# Altium schematic sheet Sheet_1_2020-09-11_10-02-54.schdoc
size 263 x 167 mm
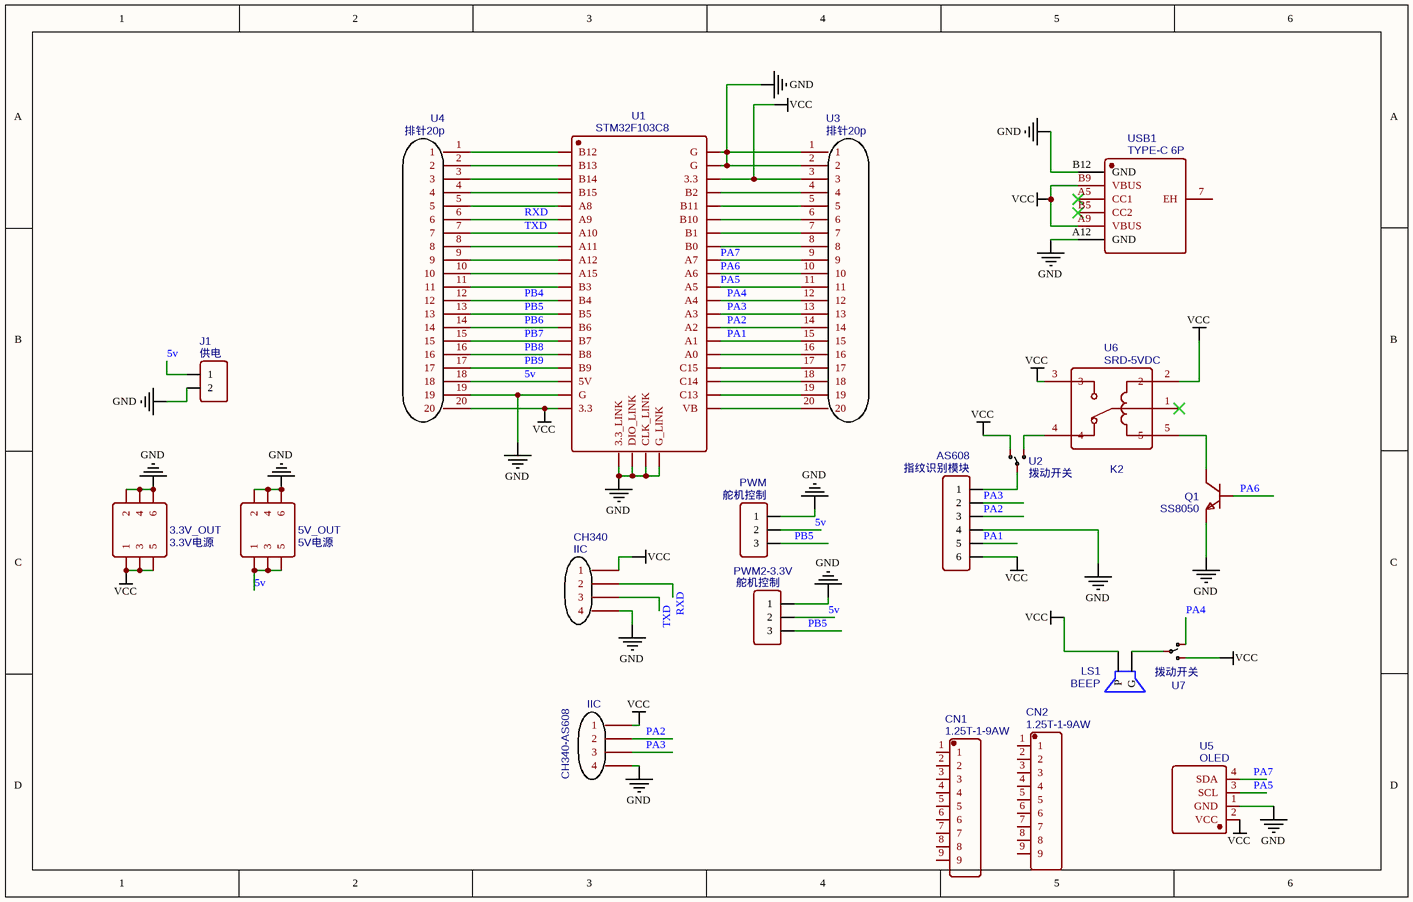
[diagram p0: Sheet_1_2020-09-11_10-02-54.schdoc]

## Parts
3.3V_OUT  3.3V电源  [HDR-TH_6P-P2.54-V-R2-C3-S2.54]
5V_OUT  5V电源  [HDR-TH_6P-P2.54-V-R2-C3-S2.54]
AS608  指纹识别模块  [HDR-M-2.54_1X6]
CH340  IIC  [HANDER*4]
CH340-AS608  IIC  [HANDER*4]
CN1  1.25T-1-9AW  [CONN-TH_9P-P1.25-H_1.25T-1-9AW]
CN2  1.25T-1-9AW  [CONN-TH_9P-P1.25-H_1.25T-1-9AW]
J1  供电  [HDR-M-2.54_1X2]
LS1  BEEP  [BEEP-9]
PWM  舵机控制  [HDR-M-2.54_1X3]
PWM2-3.3V  舵机控制  [HDR-M-2.54_1X3]
Q1  SS8050  [TO-92_FORMING1]
U1  STM32F103C8  [STM32F103C8T6-CORE]
U2  拨动开关  [拨动开关-SS12D00G3]
U3  排针20p  [排针-2.54间距-1*20P]
U4  排针20p  [排针-2.54间距-1*20P]
U5  OLED  [0.96_OLED]
U6  SRD-5VDC  [SRD-05VDC-SL-C]
U7  拨动开关  [拨动开关-SS12D00G3]
USB1  TYPE-C 6P  [TYPE-C-SMD_TYPE-C-6P]

## Nets
GND: 3.3V_OUT.2 3.3V_OUT.4 3.3V_OUT.6 5V_OUT.2 5V_OUT.4 5V_OUT.6 AS608.4 CH340.4 CH340-AS608.4 J1.2 PWM.1 PWM2-3.3V.1 Q1.1(E) U1.19(G) U1.39(G) U1.40(G) U1.41(3.3_LINK) U1.42(DIO_LINK) U1.43(CLK_LINK) U1.44(G_LINK) U3.1 U3.2 U4.19 U5.1(GND) USB1.A12(GND) USB1.B12(GND)
VCC: 3.3V_OUT.1 3.3V_OUT.3 3.3V_OUT.5 AS608.6 CH340.1 CH340-AS608.1 LS1.1(P) U1.20(3.3) U1.38(3.3) U2.3 U3.3 U4.20 U5.2(VCC) U6.2 U6.3 U7.1 USB1.A9(VBUS) USB1.B9(VBUS)
5v: 5V_OUT.1 5V_OUT.3 5V_OUT.5 J1.1 PWM.2 PWM2-3.3V.2 U1.18(5V) U4.18
PA1: AS608.5 U1.26(A1) U3.15
PA2: AS608.3 CH340-AS608.2 U1.27(A2) U3.14
PA3: AS608.2 CH340-AS608.3 U1.28(A3) U3.13
PA4: U1.29(A4) U3.12 U7.3
PA5: U1.30(A5) U3.11 U5.3(SCL)
PA6: Q1.2(B) U1.31(A6) U3.10
PA7: U1.32(A7) U3.9 U5.4(SDA)
PB4: U1.12(B4) U4.12
PB5: PWM.3 PWM2-3.3V.3 U1.13(B5) U4.13
PB6: U1.14(B6) U4.14
PB7: U1.15(B7) U4.15
PB8: U1.16(B8) U4.16
PB9: U1.17(B9) U4.17
RXD: CH340.2 U1.6(A9) U4.6
TXD: CH340.3 U1.7(A10) U4.7
NetAS608_1: AS608.1 U2.2
NetLS1_2: LS1.2(G) U7.2
NetQ1_3: Q1.3(C) U6.5
NetU1_1: U1.1(B12) U4.1
NetU1_2: U1.2(B13) U4.2
NetU1_3: U1.3(B14) U4.3
NetU1_4: U1.4(B15) U4.4
NetU1_5: U1.5(A8) U4.5
NetU1_8: U1.8(A11) U4.8
NetU1_9: U1.9(A12) U4.9
NetU1_10: U1.10(A15) U4.10
NetU1_11: U1.11(B3) U4.11
NetU1_21: U1.21(VB) U3.20
NetU1_22: U1.22(C13) U3.19
NetU1_23: U1.23(C14) U3.18
NetU1_24: U1.24(C15) U3.17
NetU1_25: U1.25(A0) U3.16
NetU1_33: U1.33(B0) U3.8
NetU1_34: U1.34(B1) U3.7
NetU1_35: U1.35(B10) U3.6
NetU1_36: U1.36(B11) U3.5
NetU1_37: U1.37(B2) U3.4
NetU2_1: U2.1 U6.4

Not connected (* = marked no-connect by the designer): CN1 1 2 3 4 5 6 7 8 9; CN2 1 2 3 4 5 6 7 8 9; U6 1*; USB1 7(EH) A5(CC1)* B5(CC2)*

## Notes on the sheet
- (in symbol SRD-5VDC) K2

## Library data of the parts
3.3V_OUT = 3.3V电源: BOM_Manufacturer: BOOMELE; BOM_Manufacturer Part: Header-Male-2.54_2x3; BOM_Supplier: LCSC; BOM_Supplier Part: C65114; spicePre: J; spiceSymbolName: Header-Male-2.54_2x3
5V_OUT = 5V电源: BOM_Manufacturer: BOOMELE; BOM_Manufacturer Part: Header-Male-2.54_2x3; BOM_Supplier: LCSC; BOM_Supplier Part: C65114; spicePre: J; spiceSymbolName: Header-Male-2.54_2x3
AS608 = 指纹识别模块: Contributor: LCEDA_Lib; BOM_Supplier Part: C190819; BOM_Supplier: LCSC; spicePre: J; spiceSymbolName: HDR-M-2.54_1x6
CH340 CH340-AS608 = IIC: Contributor: lzzzzzz; spicePre: U; spiceSymbolName: HANDER*4
CN1 CN2 = 1.25T-1-9AW: BOM_Manufacturer: BOOMELE; BOM_Supplier: LCSC; BOM_Manufacturer Part: 1.25T-1-9AW; BOM_Supplier Part: C10839; spicePre: C; spiceSymbolName: 1.25T-1-9AW
J1 = 供电: Contributor: LCEDA_Lib; BOM_Supplier Part: C124375; BOM_Supplier: LCSC; spicePre: J; spiceSymbolName: HDR-M-2.54_1x2
LS1 = BEEP: Contributor: nibo; spicePre: L; spiceSymbolName: BEEP
PWM PWM2-3.3V = 舵机控制: Contributor: LCEDA_Lib; BOM_Supplier Part: C180248; BOM_Supplier: LCSC; spicePre: J; spiceSymbolName: HDR-M-2.54_1x3
Q1 = SS8050: BOM_Manufacturer: CJ; BOM_Supplier: LCSC; BOM_Manufacturer Part: SS8050; image: //image.lceda.cn/szlcsc/C80297.jpg; BOM_Supplier Part: C80297; spicePre: Q; spiceSymbolName: SS8050
U1 = STM32F103C8: Contributor: TMHZ; spicePre: X; spiceSymbolName: STM32F103C8
U2 U7 = 拨动开关: Contributor: ShiKerFamily; BOM_Supplier: LCSC; spicePre: U; spiceSymbolName: 拨动开关-SS12D00G3
U3 U4 = 排针20p: Contributor: liugj; spicePre: U; spiceSymbolName: 排针20p
U5 = OLED: Contributor: Sheikah; spicePre: U; spiceSymbolName: OLED
U6 = SRD-5VDC: Contributor: Jensen; spicePre: U; spiceSymbolName: SRD-5VDC
USB1 = TYPE-C 6P: BOM_Manufacturer: SHOU HAN; Contributor: youzige; BOM_Supplier: LCSC; BOM_Supplier Part: C456012; BOM_Manufacturer Part: TYPE-C 6P; spicePre: U; spiceSymbolName: TYPE-C 6P